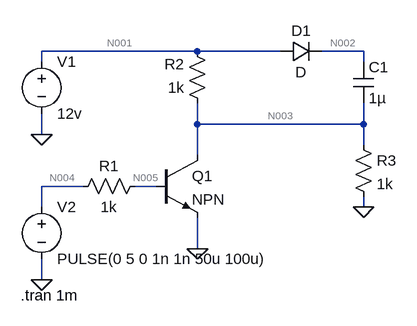
[diagram p0: schematic charge-pump.asc]
charge-pump.asc, the LTspice schematic file:
Version 4
SHEET 1 912 680
WIRE 208 -16 -32 -16
WIRE 336 -16 208 -16
WIRE 464 -16 400 -16
WIRE -32 0 -32 -16
WIRE 464 0 464 -16
WIRE 208 96 208 64
WIRE 464 96 464 64
WIRE 464 96 208 96
WIRE -32 112 -32 80
WIRE 464 128 464 96
WIRE 208 144 208 96
WIRE 32 192 -32 192
WIRE 144 192 112 192
WIRE -32 224 -32 192
WIRE 464 224 464 208
WIRE 208 288 208 240
WIRE -32 336 -32 304
FLAG -32 112 0
FLAG -32 336 0
FLAG 208 288 0
FLAG 464 224 0
SYMBOL voltage -32 -16 R0
WINDOW 123 0 0 Left 0
WINDOW 39 0 0 Left 0
SYMATTR InstName V1
SYMATTR Value 12v
SYMBOL voltage -32 208 R0
WINDOW 123 0 0 Left 0
WINDOW 39 0 0 Left 0
SYMATTR InstName V2
SYMATTR Value PULSE(0 5 0 1n 1n 50u 100u)
SYMBOL npn 144 144 R0
SYMATTR InstName Q1
SYMBOL res 128 176 R90
WINDOW 0 0 56 VBottom 2
WINDOW 3 32 56 VTop 2
SYMATTR InstName R1
SYMATTR Value 1k
SYMBOL res 224 80 R180
WINDOW 0 36 76 Left 2
WINDOW 3 36 40 Left 2
SYMATTR InstName R2
SYMATTR Value 1k
SYMBOL diode 336 0 R270
WINDOW 0 32 32 VTop 2
WINDOW 3 0 32 VBottom 2
SYMATTR InstName D1
SYMBOL cap 448 0 R0
SYMATTR InstName C1
SYMATTR Value 1µ
SYMBOL res 448 112 R0
SYMATTR InstName R3
SYMATTR Value 1k
TEXT -64 360 Left 2 !.tran 1m

The netlist it stands for:
* charge-pump.asc
V1 N001 0 12v
V2 N004 0 PULSE(0 5 0 1n 1n 50u 100u)
Q1 N003 N005 0 0 NPN
R1 N005 N004 1k
R2 N003 N001 1k
D1 N001 N002 D
C1 N002 N003 1µ
R3 N003 0 1k
.model D D
.lib standard.dio
.model NPN NPN
.model PNP PNP
.lib standard.bjt
.tran 1m
.backanno
.end

* Results of the author's LTspice run, read from the files saved beside the schematic
* Operating Point, zero values left out:
*   V(n001) = 12 V
*   V(n003) = 6 V
*   V(n002) = 12 V
*   Ic(Q1) = 6 pA
*   Ib(Q1) = -6 pA
*   I(R3) = 6 mA
*   I(R2) = -6 mA
*   I(R1) = 6 pA
*   I(V2) = 6 pA
*   I(V1) = -6 mA
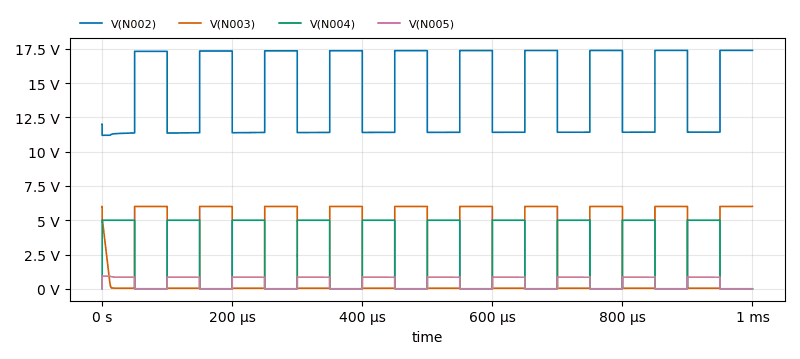
[diagram p1: Transient Analysis of charge-pump.asc, plotted from the saved traces]
* Transient Analysis, 1 run:
*   V(N002): min 11.19 V, max 17.38 V, average 14.37 V, rms 14.68 V, last 17.38 V
*   V(N003): min 41.77 mV, max 6 V, average 3.054 V, rms 4.257 V, last 6 V
*   V(N004): min 0 V, max 5 V, average 2.5 V, rms 3.536 V, last 0 V
*   V(N005): min 0 V, max 929.7 mV, average 427 mV, rms 603.9 mV, last 0 V